# EAGLE schematic mb-001 (EAGLE 9.6.2)
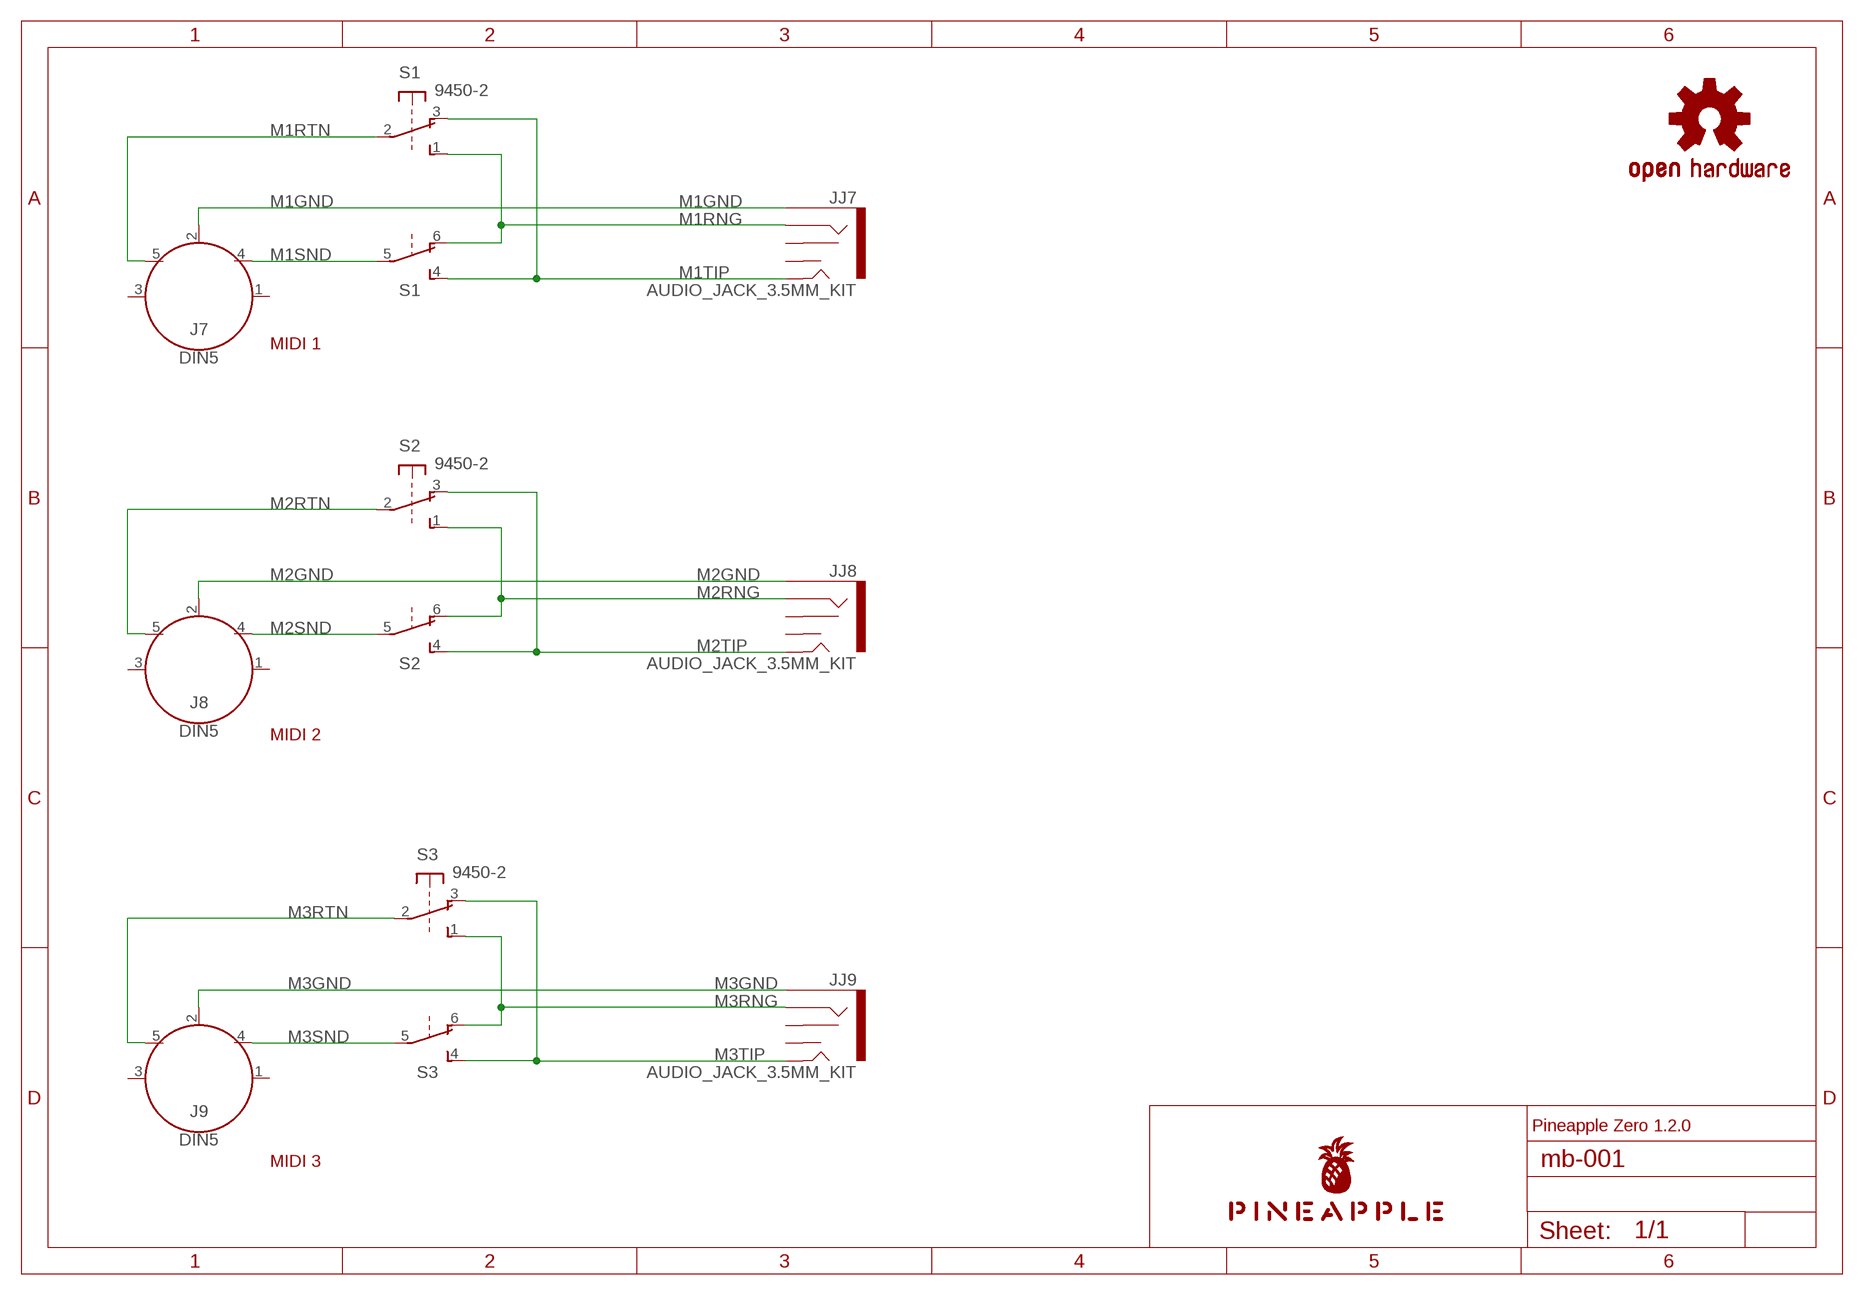
[diagram p0: schematic, sheet 1]

## Parts
J7  DIN5  [DIN5-RA-PTH]
J8  DIN5  [DIN5-RA-PTH]
J9  DIN5  [DIN5-RA-PTH]
JJ7  AUDIO_JACK_3.5MM_KIT  [AUDIO-JACK-KIT]
JJ8  AUDIO_JACK_3.5MM_KIT  [AUDIO-JACK-KIT]
JJ9  AUDIO_JACK_3.5MM_KIT  [AUDIO-JACK-KIT]
LOGO1  OSHW-LOGOS-COPPER  [OSHW-LOGO-S_COPPER]
S1  9450-2  [9450-2]
S2  9450-2  [9450-2]
S3  9450-2  [9450-2]
U$1  PINEAPPLE450  [PINEAPPLE450]

## Nets
M1GND [gnd]: J7.2 JJ7.SLEEVE
M1RNG: JJ7.RING S1.1(1:S) S1.6(2:O)
M1RTN: J7.5 S1.2(1:P)
M1SND: J7.4 S1.5(2:P)
M1TIP: JJ7.TIP S1.3(1:O) S1.4(2:S)
M2GND [gnd]: J8.2 JJ8.SLEEVE
M2RNG: JJ8.RING S2.1(1:S) S2.6(2:O)
M2RTN: J8.5 S2.2(1:P)
M2SND: J8.4 S2.5(2:P)
M2TIP: JJ8.TIP S2.3(1:O) S2.4(2:S)
M3GND [gnd]: J9.2 JJ9.SLEEVE
M3RNG: JJ9.RING S3.1(1:S) S3.6(2:O)
M3RTN: J9.5 S3.2(1:P)
M3SND: J9.4 S3.5(2:P)
M3TIP: JJ9.TIP S3.3(1:O) S3.4(2:S)
Unconnected: J7.1 J7.3 J8.1 J8.3 J9.1 J9.3 JJ7.RSH JJ7.TSH JJ8.RSH JJ8.TSH JJ9.RSH JJ9.TSH

## Notes on the sheet
- MIDI 1
- MIDI 2
- Pineapple Zero 1.2.0
- MIDI 3

## Library data of the parts
J7-J9 = SparkFun-Connectors:DIN5: DIN5 Connector - Female Right Angle (frequently used as a MIDI Jack connector) This type of connector and cable is frequently used for transmitting midi data (musical instrument digital interface). It is what you usually see on a keyboard or set of electronic drums. Learn more here <https://en.wikipedia.org/wiki/MIDI>. For more information on the pinout and electrical specifications of MIDI communications, please see the following resource: https://www.midi.org/specifications/item/midi-din-electrical-specification Here is the connector we sell at SparkFun: MIDI Connector - Female Right Angle <https://www.sparkfun.com/products/9536> (PRT-09536) Datasheet <hhttp://www.sparkfun.com/datasheets/Prototyping/Connectors/MIDI-RA.pdf> It is used on this SparkFun product: SparkFun MIDI Shield <https://www.sparkfun.com/products/12898> (DEV-12898); PROD_ID: CONN-09481
JJ7-JJ9 = SparkFun-Connectors:AUDIO_JACK_3.5MM: Audio Jack 3.5mm variants of PTH and SMT stereo audio jack with bypass switches. SparkFun Products: SparkFun SparkPunk Sound Kit <[https://www.sparkfun.com/products/11177]> - PTH MP3 Trigger <https://www.sparkfun.com/products/13720> -3.5mm SMD SparkFun PicoBoard <https://www.sparkfun.com/products/11888>- 2.5mm SMD; PROD_ID: CONN-08774; SF_ID: PRT-08032
LOGO1 = SparkFun-Aesthetics:OSHW-LOGO: Open-Source Hardware (OSHW) Logo This logo indicates the piece of hardware it is found on incorporates a OSHW license and/or adheres to the definition of open source hardware found here: http://freedomdefined.org/OSHW
S1-S3 = switch-misc:9450-2: MARQUARDT SWITCH
U$1 = pineapple:PINEAPPLE450

## Net classes
0 default: width 0.152 mm, drill 0.152 mm, clearance 0.152 mm
1 pwr: width 0.305 mm, drill 0.152 mm, clearance 0.152 mm
2 gnd: width 0.305 mm, drill 0.152 mm, clearance 0.152 mm